# EAGLE design ford_giraffe (EAGLE 9.0.0)
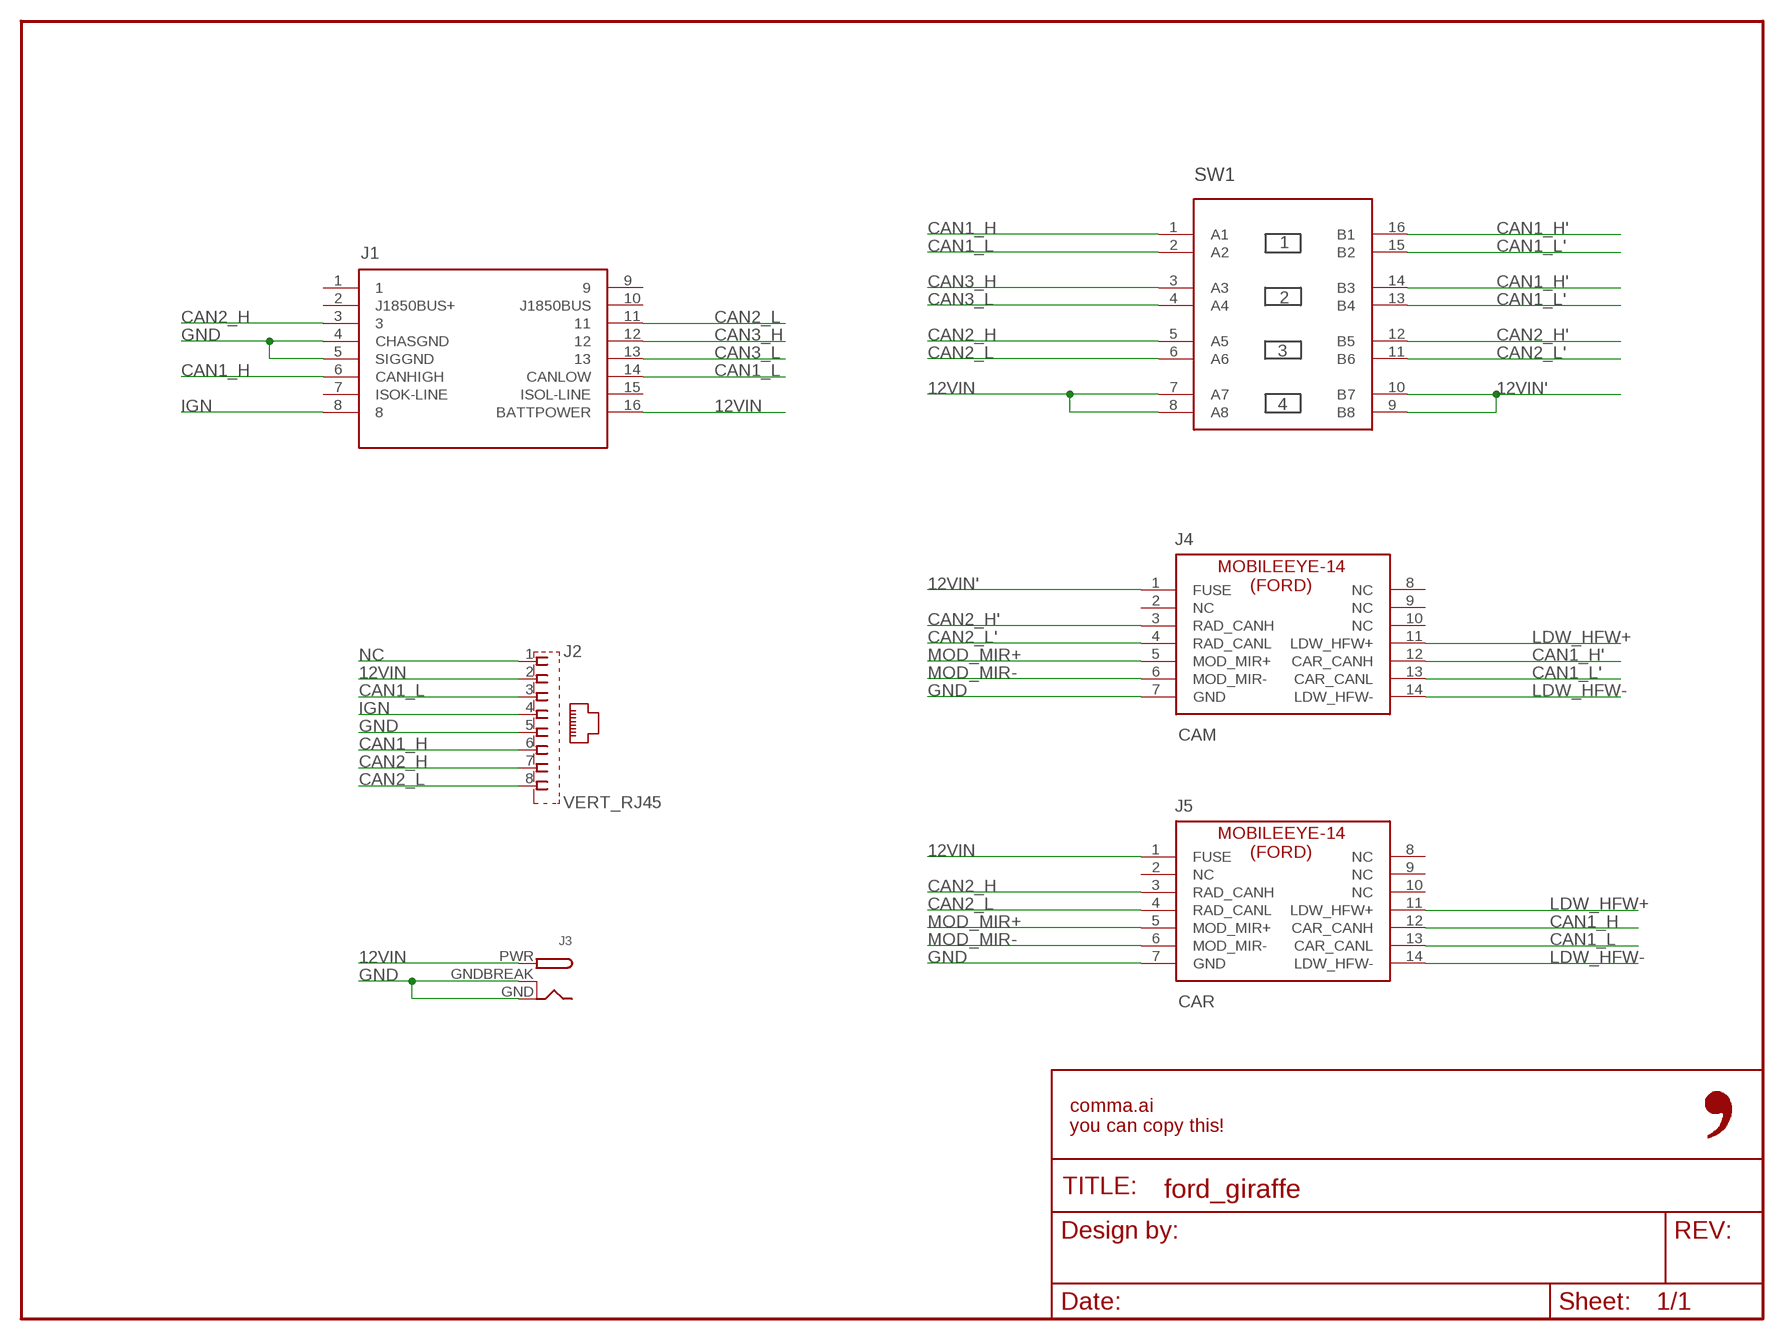
[diagram p0: schematic, sheet 1]

## Parts
FRAME1  FRAME-LETTER-OPENNO_PACKAGE  [DUMMY]
J1  OBDII-FEMALE-CUT  [OBDII-FEMALE-MIDCUT]
J2  VERT_RJ45  [GLX-S-88M]
J3  DCBARRELPTH  [DCJACK_2MM_PTH]
J4  CAM  MOBILEEYE-14-F  [2X7-FORD-CAR]
J5  CAR  MOBILEEYE-14-M  [2X7-FORD-CAM]
SW1  4XDPSTSMT  [4-DPST]

## Nets
12VIN: J1.16(BATTPOWER) J2.2 J3.PWR J5.1(FUSE) SW1.7(A7) SW1.8(A8)
12VIN': J4.1(FUSE) SW1.9(B8) SW1.10(B7)
CAN1_H: J1.6(CANHIGH) J2.6 J5.12(CAR_CANH) SW1.1(A1)
CAN1_H': J4.12(CAR_CANH) SW1.14(B3) SW1.16(B1)
CAN1_L: J1.14(CANLOW) J2.3 J5.13(CAR_CANL) SW1.2(A2)
CAN1_L': J4.13(CAR_CANL) SW1.13(B4) SW1.15(B2)
CAN2_H: J1.3 J2.7 J5.3(RAD_CANH) SW1.5(A5)
CAN2_H': J4.3(RAD_CANH) SW1.12(B5)
CAN2_L: J1.11 J2.8 J5.4(RAD_CANL) SW1.6(A6)
CAN2_L': J4.4(RAD_CANL) SW1.11(B6)
CAN3_H: J1.12 SW1.3(A3)
CAN3_L: J1.13 SW1.4(A4)
GND: J1.4(CHASGND) J1.5(SIGGND) J2.5 J3.GND J3.GNDBREAK J4.7(GND) J5.7(GND)
IGN: J1.8 J2.4
LDW_HFW+: J4.11(LDW_HFW+) J5.11(LDW_HFW+)
LDW_HFW-: J4.14(LDW_HFW-) J5.14(LDW_HFW-)
MOD_MIR+: J4.5(MOD_MIR+) J5.5(MOD_MIR+)
MOD_MIR-: J4.6(MOD_MIR-) J5.6(MOD_MIR-)
NC: J2.1
Unconnected: J1.1 J1.2(J1850BUS+) J1.7(ISOK-LINE) J1.9 J1.10(J1850BUS) J1.15(ISOL-LINE) J4.2(NC) J4.8(NC) J4.9(NC) J4.10(NC) J5.2(NC) J5.8(NC) J5.9(NC) J5.10(NC)

## Library data of the parts
FRAME1 = comma.ai:FRAME-LETTER-OPEN: Schematic Frame - Letter Standard 8.5x11 US Letter frame; DESIGNER: Nobody; VERSION: v01
J1 = comma.ai:OBDII-FEMALE
J2 = comma.ai:VERT_RJ45: Mod. Jack, Right Angle, 8 posiotion, 8 contatcs RJ45 Source: GLX-S-88M.pdf; OC_FARNELL: unknown; OC_NEWARK: unknown
J3 = comma.ai:DCBARREL: 2.0mm DC Barrel Jack DCJACK_2MM_PTH - Through Hole Jack (4UConnector: 05537)
J4 J5 = comma.ai:MOBILEEYE-14
SW1 = comma.ai:4XDPST

## Board
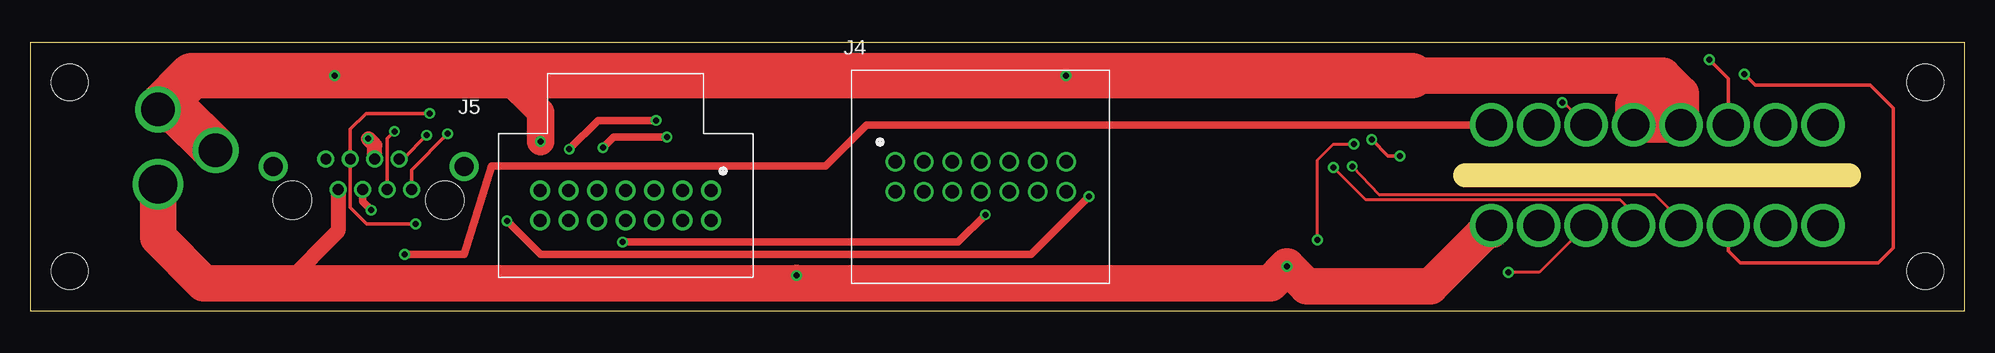
[diagram p1: board, top side]
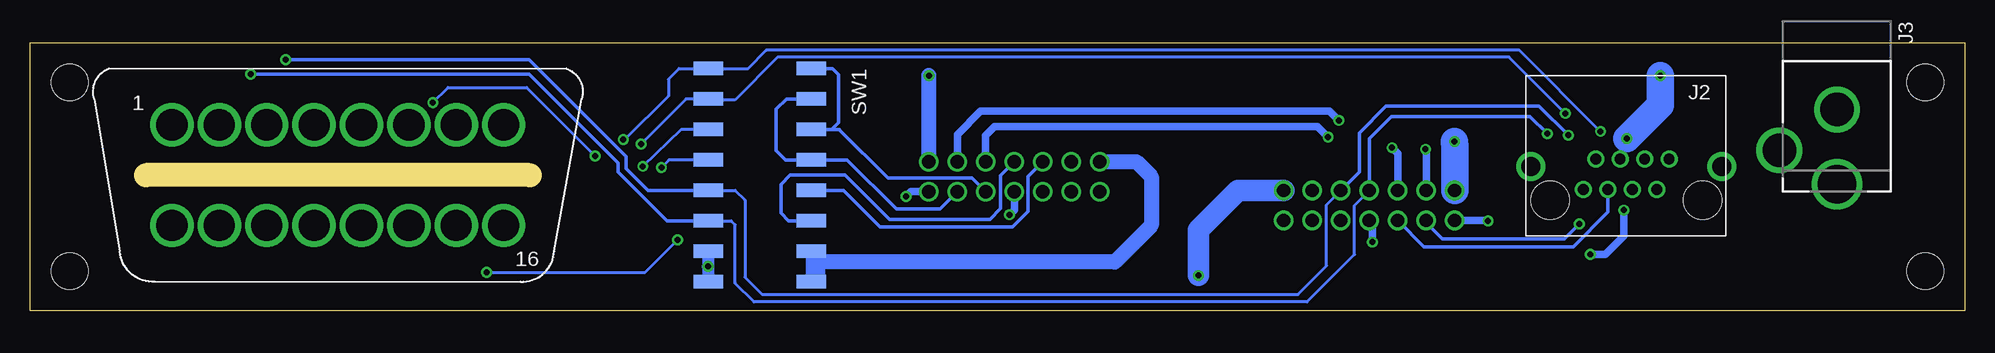
[diagram p2: board, bottom side, seen from below]

Size 161.29 x 22.35 mm. Coordinates in mm from the lower left corner, seen from the top.
Outline: 119.63,11.3 151.64,11.3
Outline: 0,0 161.29,0 161.29,22.35 0,22.35 0,0
Copper layers (1*16): Top 0.035mm / dielectric 1.5mm / Bottom 0.035mm
Design rules "default *": minimum track width 6mil, minimum drill 0.35mm, track to track 6mil, track to pad 6mil, pad to pad 6mil, via to via 6mil, smd to smd 6mil, copper to edge 20mil, drill to drill 6mil, minimum pad ring 10mil, minimum via ring 8mil, stop-mask expansion 4mil, vias tented up to drill 0mil, thermal gap 10mil
Holes 3.05 mm at 157.99,3.3 157.99,19.05 3.3,19.05 3.3,3.3

### Footprints (pad centres in the part's own frame; a part is rotated, then mirrored left to right if it is on the bottom)
OBDII-FEMALE-MIDCUT = drill 2.6 pad 3.4: 1 13.825,-4.2; 2 9.875,-4.2; 3 5.925,-4.2; 4 1.975,-4.2; 5 -1.975,-4.2; 6 -5.925,-4.2; 7 -9.875,-4.2; 8 -13.825,-4.2; 9 13.825,4.2; 10 9.875,4.2; 11 5.925,4.2; 12 1.975,4.2; 13 -1.975,4.2; 14 -5.925,4.2; 15 -9.875,4.2; 16 -13.825,4.2
GLX-S-88M = drill 0.9 pad 1.422: 1 -3.66,1.57; 2 -2.64,4.11; 3 -1.62,1.57; 4 -0.6,4.11; 5 0.42,1.57; 6 1.44,4.11; 7 2.46,1.57; 8 3.48,4.11 | drill 1.6 pad 2.184: S1 -8.04,2.2; S2 7.86,2.2 | hole 3.2: -6.44,5; 6.26,5
DCJACK_2MM_PTH = drill 2.8: GND 0,7.35; GNDBREAK 4.8,10.75 | drill 3.2: PWR 0,13.6
2X7-FORD-CAR = drill 1.1: 1 -7.125,1.25; 2 -4.75,1.25; 3 -2.375,1.25; 4 0,1.25; 5 2.375,1.25; 6 4.75,1.25; 7 7.125,1.25; 8 -7.125,-1.25; 9 -4.75,-1.25; 10 -2.375,-1.25; 11 0,-1.25; 12 2.375,-1.25; 13 4.75,-1.25; 14 7.125,-1.25
2X7-FORD-CAM = drill 1.1: 1 7.125,1.25; 2 4.75,1.25; 3 2.375,1.25; 4 0,1.25; 5 -2.375,1.25; 6 -4.75,1.25; 7 -7.125,1.25; 8 7.125,-1.25; 9 4.75,-1.25; 10 2.375,-1.25; 11 0,-1.25; 12 -2.375,-1.25; 13 -4.75,-1.25; 14 -7.125,-1.25
4-DPST = smd 1.13 x 2.44: 1 -8.89,-4.3; 2 -6.35,-4.3; 3 -3.81,-4.3; 4 -1.27,-4.3; 5 1.27,-4.3; 6 3.81,-4.3; 7 6.35,-4.3; 8 8.89,-4.3; 9 8.89,4.3; 10 6.35,4.3; 11 3.81,4.3; 12 1.27,4.3; 13 -1.27,4.3; 14 -3.81,4.3; 15 -6.35,4.3; 16 -8.89,4.3

### Placement (x,y rotation side)
FRAME1  0,0 0 top
J1  135.64,11.3 180 bottom
J2  28.32,14.22 180 bottom
J3  10.67,24.13 180 bottom
J4  79.25,11.18 0 top
J5  49.66,8.76 0 top
SW1  100.46,11.3 270 bottom

### Tracks (layer width: path | path; a pad name or v marks a point on that pad's centre or on a via)
12VIN  (via drill 0.5)
  Top 1.016: v104.78,3.68 105.28,3.68 105.41,3.81
  Top 1.27: J2.2 25.68,6.63 21.34,2.29 20.32,2.29
  Top 1.778: v63.88,2.92 63.88,2.29
  Top 3.048: 121.81,6.75 J1.16 116.74,2.03 106.43,2.03 v104.78,3.68 103.38,2.29 63.88,2.29 20.32,2.29 14.48,2.29 10.67,6.1 J3.PWR
  Bottom 1.016: SW1.7 104.76,3.7 v104.78,3.68 104.78,2.43 SW1.8
  Bottom 1.778: J5.1 60.6,10.01 63.88,6.73 v63.88,2.92
12VIN'
  Bottom 1.016: SW1.10 SW1.9 95.5,3.07 95.5,4.06
  Bottom 1.27: J4.1 69.07,12.43 67.82,11.18 67.82,7.11 70.87,4.06 95.5,4.06
CAN1_H  (via drill 0.5)
  Top 0.254: J1.6 127.87,17.35 v127.71,17.35
  Top 0.305: J2.6 29.76,14.34 v30.38,14.96 | v111.84,14.28 113.21,12.9 v114.17,12.9
  Bottom 0.254: v127.71,17.35 126.44,18.62 119.89,18.62 v114.17,12.9 | 104.78,20.17 SW1.1 | 104.78,20.17 101.47,20.17 99.92,21.72 37.13,21.72 v30.38,14.96 | 104.78,20.17 104.81,20.19 107.19,20.19 108.08,19.3 108.08,17.91 111.71,14.28 v111.84,14.28
  Bottom 0.305: J2.6 29.76,8.21 32.64,5.33 45.1,5.33 J5.12
CAN1_H'
  Bottom 0.305: 93.85,15.11 94.49,15.11 | 94.49,15.11 SW1.14 | SW1.16 94.39,20.19 93.9,19.71 93.9,15.7 94.49,15.11 | 93.83,15.11 93.85,15.11 | J4.12 82.75,11.06 84.47,11.06 84.47,11.05 85.9,11.05 85.91,11.06 86.84,11.06 86.85,11.05 89.79,11.05 93.85,15.11
CAN1_L  (via drill 0.5)
  Top 0.254: J1.14 125.81,3.2 v123.22,3.2 | v107.31,5.89 107.31,12.57 108.64,13.89 v110.36,13.89
  Top 0.305: v33.3,16.46 28.02,16.46 26.7,15.14 J2.3 26.7,8.61 28.07,7.24 v32.13,7.24
  Bottom 0.254: v123.22,3.2 110.01,3.2 v107.31,5.89 | 105.41,17.65 SW1.2 106.6,17.65 v110.36,13.89 | v33.3,16.46 38,21.16 98.96,21.16 102.54,17.58 105.33,17.58
  Bottom 0.305: 105.33,17.58 105.41,17.65 | J5.13 44.91,7.32 43.56,5.97 33.4,5.97 v32.13,7.24
CAN1_L'
  Bottom 0.305: SW1.15 98.25,17.65 99.08,16.82 99.08,13.36 98.3,12.57 SW1.13 93.17,12.57 89.06,8.47 85.45,8.47 J4.13
CAN2_H  (via drill 0.5)
  Top 0.305: v33.07,14.63 31.09,12.65 J2.7 | J1.3 141.56,19.37 v139.98,20.95
  Bottom 0.254: SW1.5 102.51,10.03 101.7,9.22 101.7,2.79 100.25,1.35 55.6,1.35 53.21,3.73 53.21,8.83 J5.3
  Bottom 0.305: J5.3 50.49,11.55 50.49,14.83 48.26,17.07 35.51,17.07 v33.07,14.63 | SW1.5 104.78,10.01 107.95,10.01 108.56,10.01 109.77,10.01 111.6,11.84 111.6,12.87 119.69,20.95 v139.98,20.95
CAN2_H'
  Bottom 0.305: J4.3 78.11,11.19 78.11,8.26 79.38,6.99 90.42,6.99 93.47,10.03 SW1.12
CAN2_L  (via drill 0.5)
  Top 0.305: v34.82,14.76 31.8,11.73 J2.8 | J1.11 141.56,4.97 142.54,3.99 154.08,3.99 155.32,5.23 155.32,16.92 153.42,18.82 143.81,18.82 v142.9,19.74
  Bottom 0.254: SW1.6 102.84,7.49 102.51,7.16 102.51,2.29 100.94,0.71 54.84,0.71 50.88,4.67 50.88,8.79 J5.4
  Bottom 0.305: J5.4 49.66,14.38 47.83,16.2 36.27,16.2 v34.82,14.76 | v142.9,19.74 119.69,19.74 112.27,12.32 112.27,11.56 108.2,7.49 SW1.6
CAN2_L'
  Bottom 0.305: SW1.11 98.04,7.49 98.68,8.13 98.68,10.54 97.92,11.3 93.34,11.3 89.66,7.62 81.28,7.62 80.39,8.51 80.39,11.28 J4.4
CAN3_H  (via drill 0.5)
  Top 0.254: v110.21,12.04 112.45,9.68 135.43,9.68 137.61,7.5 J1.12
  Bottom 0.254: SW1.3 107.01,15.11 v110.21,12.04
CAN3_L  (via drill 0.5)
  Top 0.254: v108.66,11.94 111.33,9.27 132.54,9.27 133.66,8.15 J1.13
  Bottom 0.254: SW1.4 108.03,12.57 v108.66,11.94
GND  (via drill 0.5)
  Top 1.27: J2.5 28.74,13.8 v28.19,14.35
  Top 2.286: v42.55,14.1 42.55,16.56 39.5,19.61
  Top 3.048: 115.19,19.61 136.09,19.61 137.61,18.09 | 137.61,18.09 J1.4 J1.5 | J1.5 135.02,15.5 137.61,18.09 | J1.5 133.66,17.23 134.82,18.39
  Top 3.81: 115.19,19.61 v86.36,19.61 39.5,19.61 v25.4,19.61 13.5,19.61 J3.GND 12.07,16.78 J3.GNDBREAK
  Bottom 1.27: J4.7 86.37,19.6 v86.36,19.61
  Bottom 2.286: v28.19,14.35 25.4,17.14 v25.4,19.61 | J5.7 42.53,13.7 v42.55,14.1
IGN  (via drill 0.5)
  Top 0.61: J2.4 27.72,9.11 v28.45,8.38 | v31.24,4.7 36.2,4.7 38.48,12.06 66.29,12.06 69.72,15.49 J1.8
  Bottom 0.61: v28.45,8.38 28.45,6.22 29.97,4.7 v31.24,4.7
LDW_HFW+  (via drill 0.5)
  Top 0.61: v79.63,8 77.34,5.71 v49.4,5.71
  Bottom 0.61: J4.11 79.25,8.38 v79.63,8 | v49.4,5.71 49.4,7.26 J5.11
LDW_HFW-  (via drill 0.5)
  Top 0.61: v88.27,9.53 83.44,4.7 42.55,4.7 v39.75,7.49
  Bottom 0.61: J4.14 87.86,9.93 v88.27,9.53 | v39.75,7.49 39.77,7.51 J5.14
MOD_MIR+  (via drill 0.5)
  Top 0.61: v47.75,13.59 48.64,14.48 v53.09,14.48
  Bottom 0.61: J5.5 47.28,13.12 v47.75,13.59 | v53.09,14.48 53.98,15.37 80.9,15.37 81.66,14.61 81.66,12.46 J4.5
MOD_MIR-  (via drill 0.5)
  Top 0.61: v52.2,15.88 47.37,15.88 v44.96,13.46
  Bottom 0.61: J4.6 84,14.68 82.04,16.64 52.96,16.64 v52.2,15.88 | v44.96,13.46 44.91,13.41 J5.6